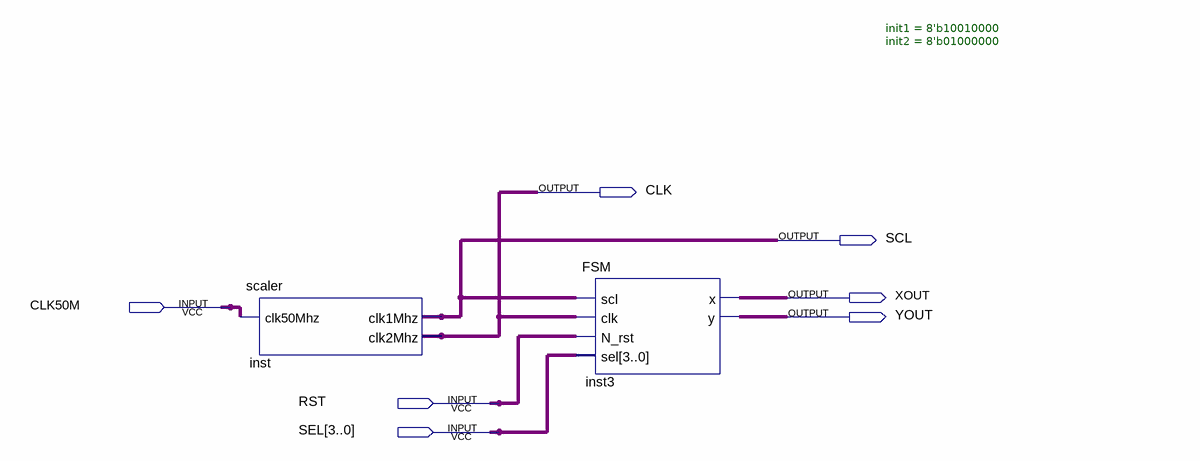
[diagram p0: schematic sheet]
// Quartus schematic Display.bdf as structural Verilog: 2 symbols, 7 pins
module Display (
  input  CLK50M,
  input  RST,
  input  [3:0] SEL,
  output CLK,
  output SCL,
  output XOUT,
  output YOUT
);

  scaler inst (.clk50Mhz(CLK50M), .clk1Mhz(SCL), .clk2Mhz(CLK));
  FSM #(.init1(8'b10010000), .init2(8'b01000000)) inst3 (
    .scl(SCL), .clk(CLK), .N_rst(RST), .sel(SEL), .x(XOUT), .y(YOUT));
endmodule
